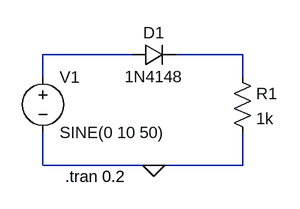
[diagram p0: schematic 3-hw.asc]
3-hw.asc, the LTspice schematic file:
Version 4.1
SHEET 1 880 680
WIRE 176 96 48 96
WIRE 336 96 240 96
WIRE 48 128 48 96
WIRE 336 128 336 96
WIRE 48 256 48 208
WIRE 208 256 48 256
WIRE 336 256 336 208
WIRE 336 256 208 256
FLAG 208 256 0
SYMBOL voltage 48 112 R0
WINDOW 123 0 0 Left 0
WINDOW 39 0 0 Left 0
SYMATTR InstName V1
SYMATTR Value SINE(0 10 50)
SYMBOL res 320 112 R0
SYMATTR InstName R1
SYMATTR Value 1k
SYMBOL diode 176 112 R270
WINDOW 0 32 32 VTop 2
WINDOW 3 0 32 VBottom 2
SYMATTR InstName D1
SYMATTR Value 1N4148
TEXT 80 272 Left 2 !.tran 0.2

The netlist it stands for:
* 3-hw.asc
V1 N001 0 SINE(0 10 50)
R1 N002 0 1k
D1 N001 N002 1N4148
.model D D
.lib standard.dio
.tran 0.2
.backanno
.end